# EasyEDA schematic SCH_Focus_Dial.json
TITLE: Sheet_1; REV: 1.0; Date: 2026-06-28; Sheet: 1/1; Drawn By: latadixit11011985; Company: Your Company
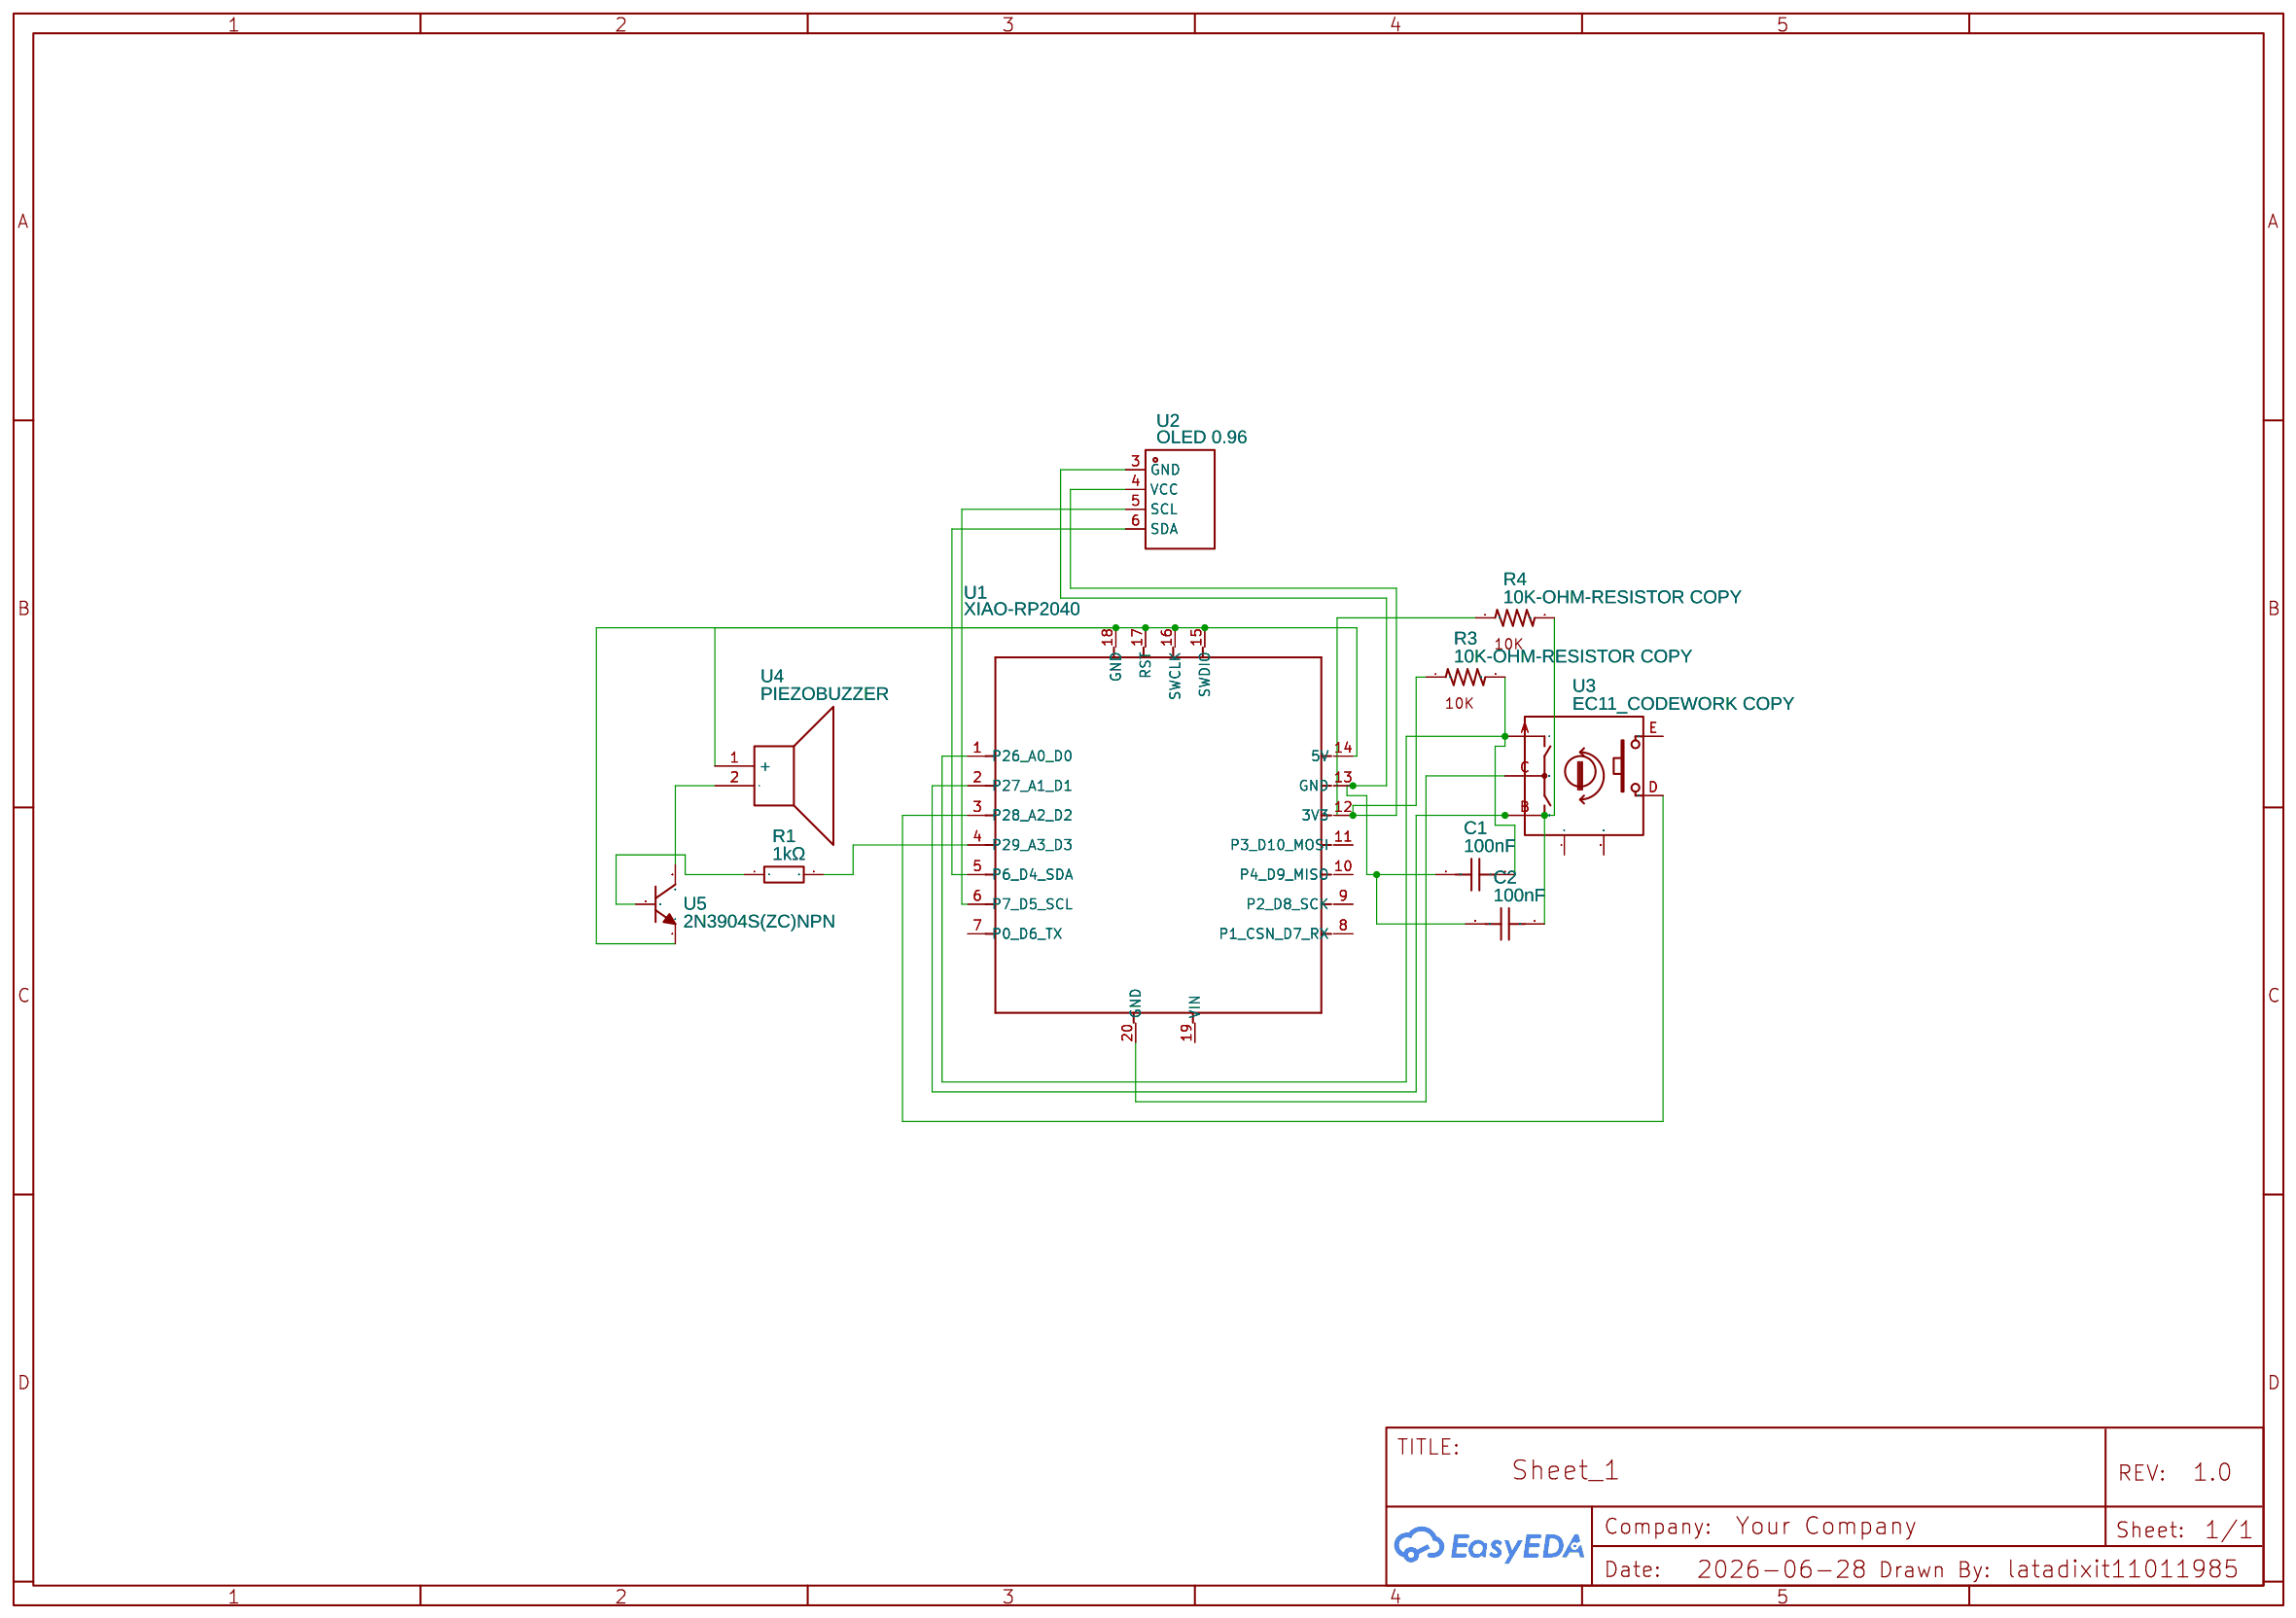
[diagram p0: schematic sheet]

## Parts
C1  100nF  [CAPACITOR, 2.54MM PIN CAPACITOR]
C2  100nF  [CAPACITOR, 2.54MM PIN CAPACITOR]
R1  1kΩ  [1K-OHM-RESISTOR]
R3  10K-OHM-RESISTOR COPY  [10K-OHM-RESISTOR]
R4  10K-OHM-RESISTOR COPY  [10K-OHM-RESISTOR]
U1  XIAO-RP2040  [XIAO-SAMD21/RP2040-MODULE14P-2.54-21X17.8MM]
U2  OLED 0.96  [OLED-TH_OLED0.96-I2C]
U3  EC11_CODEWORK COPY  [EC11-TH_EC110201E2J-HA1-005]
U4  PIEZOBUZZER  [PIEZOBUZZER]
U5  2N3904S(ZC)NPN  [SOT-23-3_L2.9-W1.3-P0.95-LS2.4-BR]

## Library data of the parts
C1 C2 = C_0603_US: Contributor: antonioguadalupe265
R1 = 1K-OHM-RESISTOR: Supplier: LCSC; Manufacturer: YAGEO(国巨); Manufacturer Part: RC0402FR-071KL; Supplier Part: C106235; JLCPCB Part Class: Extended Part
R3 R4 = 10K-OHM-RESISTOR: Contributor: sanjeevimaran
U1 = XIAO-RP2040: Contributor: angelo904
U2 = OLED 0.96 COPY: Supplier Part: AZDelivery; Manufacturer: AZDelivery; Manufacturer Part: ZJY096S0700BG01蓝色; link: https://img.jlc.com/pdf/applyPasteComponent/2022-08-15/203417A/337c2d88c1b34c958220578f8c1ccd46/ZJY096S0700WG01.pdf; Contributor: dayang78
U3 = EC11_CODEWORK COPY: Supplier: LCSC; Supplier Part: C9900147203; Manufacturer: null; Manufacturer Part: EC110201E2J-HA1-005; Contributor: FRANKC001
U4 = PIEZOBUZZER: Contributor: levachu; sourceId: mCAavtrNL
U5 = 2N3904S(ZC)NPN: Contributor: lcsc; Supplier: LCSC; Supplier Part: C9900013034; Manufacturer: null; JLCPCB Part Class: Extended Part

## Nets
Net-(C1-1): C1.1 R3.2 U1.1(P26_A0_D0) U3.A
Net-(C1-2): C1.2 C2.2 U1.13(GND) U2.3(GND)
Net-(C2-1): C2.1 R4.2 U1.2(P27_A1_D1) U3.B
Net-(R1-1): R1.1 U5.1(B)
Net-(R1-2): R1.2 U1.4(P29_A3_D3)
Net-(R3-1): R3.1 R4.1 U1.12(3V3) U2.4(VCC)
Net-(U1-3): U1.3(P28_A2_D2) U3.D
Net-(U1-5): U1.5(P6_D4_SDA) U2.6(SDA)
Net-(U1-6): U1.6(P7_D5_SCL) U2.5(SCL)
Net-(U1-14): U1.14(5V) U1.15(SWDIO) U1.16(SWCLK) U1.17(RST) U1.18(GND) U4.1(+) U5.2(E)
Net-(U1-20): U1.20(GND) U3.C
Net-(U4-2): U4.2(-) U5.3(C)

Not connected (* = marked no-connect by the designer): U1 7(P0_D6_TX) 8(P1_CSN_D7_RX) 9(P2_D8_SCK) 10(P4_D9_MISO) 11(P3_D10_MOSI) 19(VIN); U3 1 2 E
